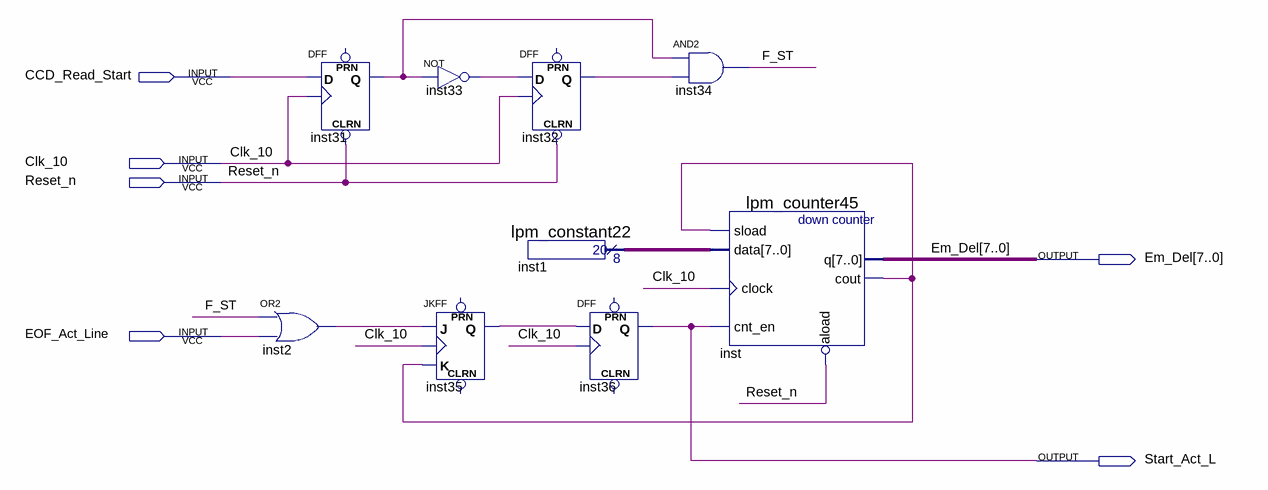
[diagram p0: schematic sheet]
// Quartus schematic Par_Gen_Emul.bdf as structural Verilog: 9 symbols, 6 pins
module Par_Gen_Emul (
  input  CCD_Read_Start,
  input  Clk_10,
  input  Reset_n,
  input  EOF_Act_Line,
  output [7:0] Em_Del,
  output Start_Act_L
);

  wire F_ST, inst2_out, inst31_q, inst32_q, inst33_out, inst35_q, inst_cout;
  wire [7:0] inst1_result;

  or inst2 (inst2_out, F_ST, EOF_Act_Line);
  DFF inst31 (.CLRN(Reset_n), .CLK(Clk_10), .D(CCD_Read_Start), .Q(inst31_q));  // open: PRN
  not inst33 (inst33_out, inst31_q);
  JKFF inst35 (.K(inst_cout), .J(inst2_out), .CLK(Clk_10), .Q(inst35_q));  // open: PRN, CLRN
  DFF inst32 (.CLRN(Reset_n), .CLK(Clk_10), .D(inst33_out), .Q(inst32_q));  // open: PRN
  lpm_constant22 inst1 (.result(inst1_result));
  DFF inst36 (.CLK(Clk_10), .D(inst35_q), .Q(Start_Act_L));  // open: CLRN, PRN
  and inst34 (F_ST, inst31_q, inst32_q);
  lpm_counter45 inst (
    .sload(inst_cout), .data(inst1_result), .clock(Clk_10), .cnt_en(Start_Act_L), .aload(~Reset_n),
    .q(Em_Del), .cout(inst_cout));
endmodule
